# Altium schematic sheet UKU208_main.SchDoc
size A3
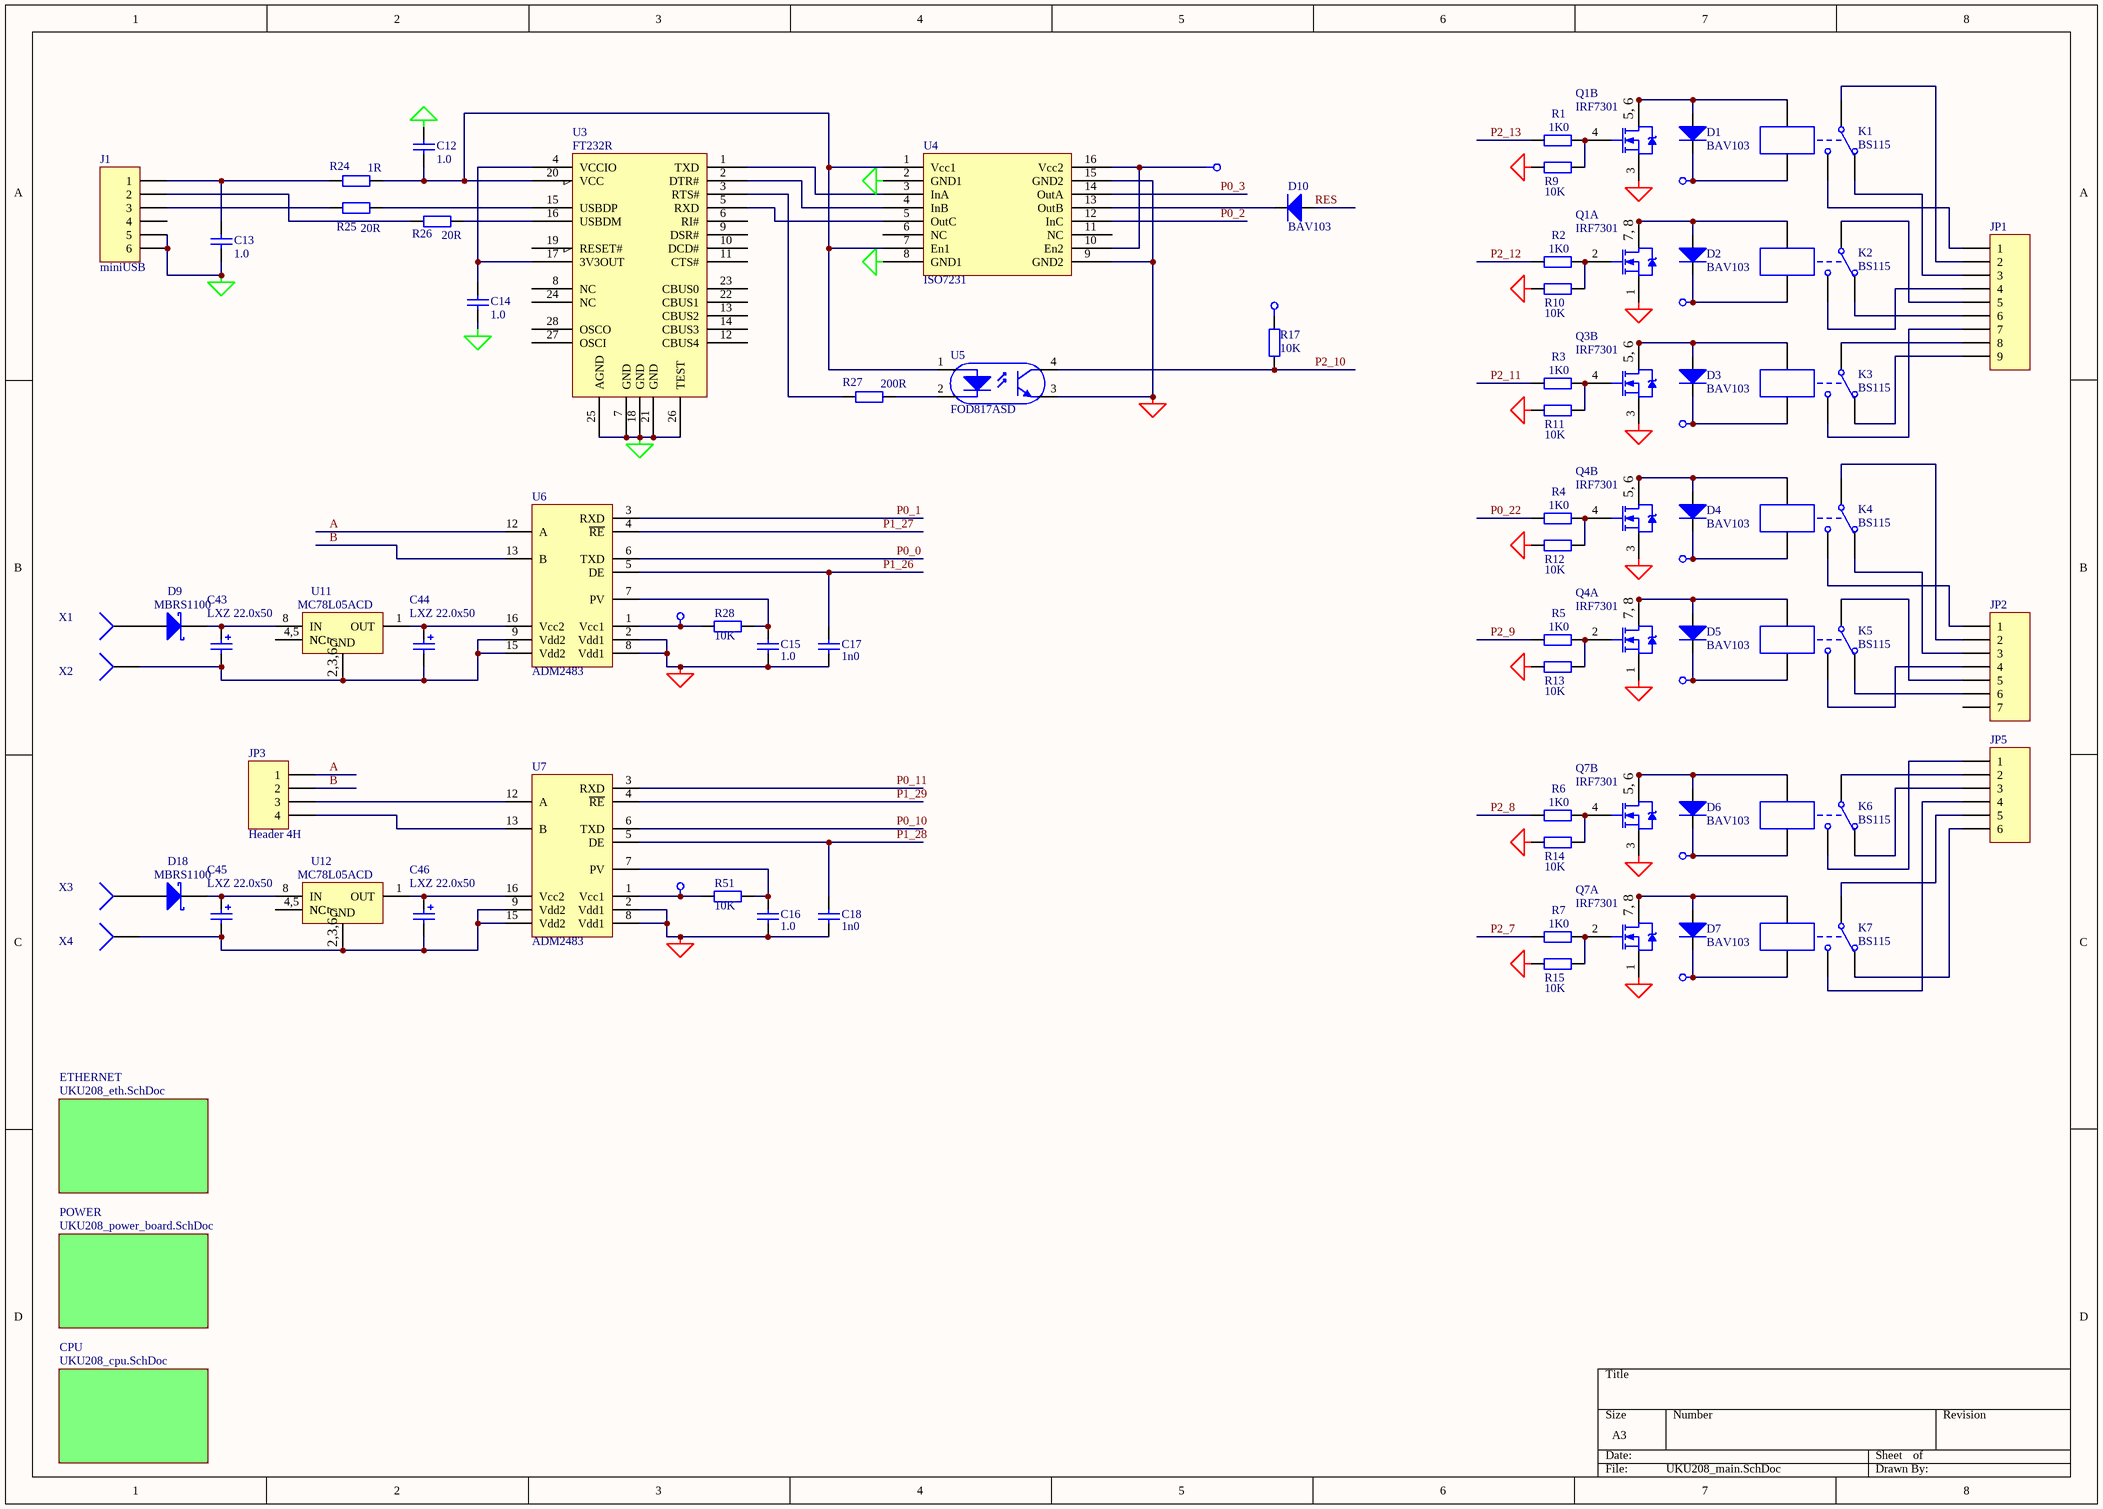
[diagram p0: UKU208_main.SchDoc]

## Parts
C12  1.0  [_1206]
C13  1.0  [_1206]
C14  1.0  [_1206]
C15  1.0  [_1206]
C16  1.0  [_1206]
C17  1n0  [_1206]
C18  1n0  [_1206]
C43  LXZ 22.0x50  [el3]
C44  LXZ 22.0x50  [el3]
C45  LXZ 22.0x50  [el3]
C46  LXZ 22.0x50  [el3]
D1  BAV103  [_1206d]
D2  BAV103  [_1206d]
D3  BAV103  [_1206d]
D4  BAV103  [_1206d]
D5  BAV103  [_1206d]
D6  BAV103  [_1206d]
D7  BAV103  [_1206d]
D9  MBRS1100  [D_6_3]
D10  BAV103  [_1206d]
D18  MBRS1100  [D_6_3]
J1  miniUSB  [USBmini]
JP1  MHDR1X9  [2EDGR-5.08-9P]  (value not drawn)
JP2  MHDR1X7  [2EDGR-5.08-7P]  (value not drawn)
JP3  Header 4H  [2EDGR-5.08-4P]
JP5  MHDR1X6  [2EDGR-5.08-6P]  (value not drawn)
K1  BS115  [bs115]
K2  BS115  [bs115]
K3  BS115  [bs115]
K4  BS115  [bs115]
K5  BS115  [bs115]
K6  BS115  [bs115]
K7  BS115  [bs115]
Q1  IRF7301  [SO-G8/Y2.2]  (parts A,B of 2)
Q3  IRF7301  [SO-G8/Y2.2]  (part B of 2)
Q4  IRF7301  [SO-G8/Y2.2]  (parts A,B of 2)
Q7  IRF7301  [SO-G8/Y2.2]  (parts A,B of 2)
R1  1K0  [_1206]
R2  1K0  [_1206]
R3  1K0  [_1206]
R4  1K0  [_1206]
R5  1K0  [_1206]
R6  1K0  [_1206]
R7  1K0  [_1206]
R9  10K  [_1206]
R10  10K  [_1206]
R11  10K  [_1206]
R12  10K  [_1206]
R13  10K  [_1206]
R14  10K  [_1206]
R15  10K  [_1206]
R17  10K  [_1206]
R24  1R  [_1206]
R25  20R  [_1206]
R26  20R  [_1206]
R27  200R  [_1206]
R28  10K  [_1206]
R51  10K  [_1206]
U3  FT232R  [SOP65P780-28L]
U4  ISO7231  [SO-G16/D10.4]
U5  FOD817ASD  [FOD817ASD]
U6  ADM2483  [SO-G16/D10.4]
U7  ADM2483  [SO-G16/D10.4]
U11  MC78L05ACD  [SO-G8]
U12  MC78L05ACD  [SO-G8]
X1  (no value)  [PIN1]
X2  (no value)  [PIN1]
X3  (no value)  [PIN1]
X4  (no value)  [PIN1]

## Sub-sheets
CPU = UKU208_cpu.SchDoc: no entries
ETHERNET = UKU208_eth.SchDoc: no entries
POWER = UKU208_power_board.SchDoc: no entries

## Nets
+3v3: R17.2
+5v: D1.2(K) D2.2(K) D3.2(K) D4.2(K) D5.2(K) D6.2(K) D7.2(K) K1.5 K2.5 K3.5 K4.5 K5.5 K6.5 K7.5 R28.1 R51.1 U4.10(En2) U4.16(Vcc2) U6.1(Vcc1) U7.1(Vcc1)
GND: C15.1 C16.1 C17.1 C18.1 Q1.1(S) Q1.3(S) Q3.3(S) Q4.1(S) Q4.3(S) Q7.1(S) Q7.3(S) R9.1 R10.1 R11.1 R12.1 R13.1 R14.1 R15.1 U4.9(GND2) U4.15(GND2) U5.3 U6.2(Vdd1) U6.8(Vdd1) U7.2(Vdd1) U7.8(Vdd1)
GND_USB: C12.1 C13.1 C14.1 J1.5 J1.6 U3.7(GND) U3.18(GND) U3.21(GND) U3.25(AGND) U3.26(TEST) U4.2(GND1) U4.8(GND1)
A: JP3.1 U6.12(A)
B: JP3.2 U6.13(B)
P0_0: U6.6(TXD)
P0_1: U6.3(RXD)
P0_2: U4.12(InC)
P0_3: U4.14(OutA)
P0_10: U7.6(TXD)
P0_11: U7.3(RXD)
P0_22: R4.1
P1_26: C17.2 U6.5(DE)
P1_27: U6.4(~{RE})
P1_28: C18.2 U7.5(DE)
P1_29: U7.4(~{RE})
P2_7: R7.1
P2_8: R6.1
P2_9: R5.1
P2_10: R17.1 U5.4
P2_11: R3.1
P2_12: R2.1
P2_13: R1.1
RES: D10.1(A)
NetC12_2: C12.2 R24.2 U3.20(VCC) U4.1(Vcc1) U4.7(En1) U5.1
NetC13_2: C13.2 J1.1 R24.1
NetC14_2: C14.2 U3.4(VCCIO) U3.17(3V3OUT)
NetC15_2: C15.2 R28.2 U6.7(PV)
NetC16_2: C16.2 R51.2 U7.7(PV)
NetC43_1: C43.1 D9.2(K) U11.8(IN)
NetC43_2: C43.2 C44.2 U6.9(Vdd2) U6.15(Vdd2) U11.2(GND) U11.3(GND) U11.6(GND) U11.7(GND) X2.1
NetC44_1: C44.1 U6.16(Vcc2) U11.1(OUT)
NetC45_1: C45.1 D18.2(K) U12.8(IN)
NetC45_2: C45.2 C46.2 U7.9(Vdd2) U7.15(Vdd2) U12.2(GND) U12.3(GND) U12.6(GND) U12.7(GND) X4.1
NetC46_1: C46.1 U7.16(Vcc2) U12.1(OUT)
NetD1_1: D1.1(A) K1.4 Q1.5(D) Q1.6(D)
NetD2_1: D2.1(A) K2.4 Q1.7(D) Q1.8(D)
NetD3_1: D3.1(A) K3.4 Q3.5(D) Q3.6(D)
NetD4_1: D4.1(A) K4.4 Q4.5(D) Q4.6(D)
NetD5_1: D5.1(A) K5.4 Q4.7(D) Q4.8(D)
NetD6_1: D6.1(A) K6.4 Q7.5(D) Q7.6(D)
NetD7_1: D7.1(A) K7.4 Q7.7(D) Q7.8(D)
NetD9_1: D9.1(A) X1.1
NetD10_2: D10.2(K) U4.13(OutB)
NetD18_1: D18.1(A) X3.1
NetJ1_2: J1.2 R26.1
NetJ1_3: J1.3 R25.1
NetJP1_1: JP1.1 K1.3
NetJP1_2: JP1.2 K1.1
NetJP1_3: JP1.3 K1.2
NetJP1_4: JP1.4 K2.3
NetJP1_5: JP1.5 K2.1
NetJP1_6: JP1.6 K2.2
NetJP1_7: JP1.7 K3.3
NetJP1_8: JP1.8 K3.1
NetJP1_9: JP1.9 K3.2
NetJP2_1: JP2.1 K4.3
NetJP2_2: JP2.2 K4.1
NetJP2_3: JP2.3 K4.2
NetJP2_4: JP2.4 K5.3
NetJP2_5: JP2.5 K5.1
NetJP2_6: JP2.6 K5.2
NetJP3_3: JP3.3 U7.12(A)
NetJP3_4: JP3.4 U7.13(B)
NetJP5_1: JP5.1 K6.3
NetJP5_2: JP5.2 K6.1
NetJP5_3: JP5.3 K6.2
NetJP5_4: JP5.4 K7.3
NetJP5_5: JP5.5 K7.1
NetJP5_6: JP5.6 K7.2
NetQ1_2: Q1.2(G) R2.2 R10.2
NetQ1_4: Q1.4(G) R1.2 R9.2
NetQ3_4: Q3.4(G) R3.2 R11.2
NetQ4_2: Q4.2(G) R5.2 R13.2
NetQ4_4: Q4.4(G) R4.2 R12.2
NetQ7_2: Q7.2(G) R7.2 R15.2
NetQ7_4: Q7.4(G) R6.2 R14.2
NetR25_2: R25.2 U3.15(USBDP)
NetR26_2: R26.2 U3.16(USBDM)
NetR27_1: R27.1 U3.3(RTS#)
NetR27_2: R27.2 U5.2
NetU3_1: U3.1(TXD) U4.3(InA)
NetU3_2: U3.2(DTR#) U4.4(InB)
NetU3_5: U3.5(RXD) U4.5(OutC)
NetU11_4: U11.4(NC) U11.5(NC)
NetU12_4: U12.4(NC) U12.5(NC)

Not connected (* = marked no-connect by the designer): J1 4; JP2 7; U3 6(RI#) 8(NC) 9(DSR#) 10(DCD#) 11(CTS#) 12(CBUS4) 13(CBUS2) 14(CBUS3) 19(RESET#) 22(CBUS1) 23(CBUS0) 24(NC) 27(OSCI) 28(OSCO); U4 6(NC) 11(NC)

## Notes on the sheet
- (in symbol IRF7301, part A) 7, 8
- (in symbol IRF7301, part B) 5, 6
- (in symbol MC78L05ACD) 4,5; 2,3,6,7

## Library data of the parts
C12-C18 = Cap Semi: Capacitor (Semiconductor SIM Model); Manufacturer: Generic Components; Class I: Passive; Value: 1,0; Published: 8-Jun-2000; Revision: July-2002: Re-released for DXP Platform.; Publisher: Altium Limited; Class II: Capacitor
C43-C46 = Cap Pol1: Polarized Capacitor (Radial); Manufacturer: Generic Components; Class I: Passive; Value: 22,0x50; Published: 8-Jun-2000; Revision: July-2002: Re-released for DXP Platform.; Publisher: Altium Limited; Class II: Capacitor
D1-D7 D10 = Diode: Manufacturer: Generic Components; Class I: Discrete; Class II: Diode - Switching; Value: LL4148; Published: 8-Jun-2000; Revision: July-2002: Re-released for DXP Platform.; Publisher: Altium Limited
D9 D18 = 10BQ015: Schottky Rectifier; Manufacturer: International Rectifier; Revision 1: 10-July-2000: SIM Model Added.; Revision 2: July-2002: Re-released for DXP Platform.; Class I: Discrete; Class II: Rectifier - Schottky; Published: 8-Jun-2000; Datasheet: Latest Revision: PD-2.396A; Package Reference: DO-214AA; Publisher: Altium Limited
J1 = Header 6: Header, 6-Pin; Value: USB-B; LatestRevisionDate: 17-Jul-2002; LatestRevisionNote: Re-released for DXP Platform.; Publisher: Altium Limited
JP1 = MHDR1X9: Header, 9-Pin; Manufacturer: Generic Components; Class I: Connector; Revision: July-2002: Re-released for DXP Platform.; Publisher: Altium Limited
JP2 = MHDR1X7: Header, 7-Pin; Manufacturer: Generic Components; Class I: Connector; Revision: July-2002: Re-released for DXP Platform.; Publisher: Altium Limited
JP3 = Header 4H: Header, 4-Pin,  Right Angle; Manufacturer: Generic Components; Class I: Connector; Revision: July-2002: Re-released for DXP Platform.; Publisher: Altium Limited
JP5 = MHDR1X6: Header, 6-Pin; Manufacturer: Generic Components; Class I: Connector; Revision: July-2002: Re-released for DXP Platform.; Publisher: Altium Limited
K1-K7 = BS115: Single-Pole Dual-Throw Relay; Manufacturer: Generic Components; Class I: Electro-mechanical; Published: 24-Mar-1999; Revision: July-2002: Re-released for DXP Platform.; Publisher: Altium Limited; Class II: Relay
Q1 Q3 Q4 Q7 = IRF7301: FET; Manufacturer: International Rectifier; Revision 1: 29-Sep-2000: Re-orientated a 'Drain' pin on first part.; Revision 2: July-2002: Re-released for DXP Platform.; Class I: Discrete; Class II: MOSFET - Power; Value: IRF7103; Published: 8-Jun-2000; Datasheet: Latest Revision: Aug-1997; Package Reference: SOIC8; Publisher: Altium Limited
R1-R7 = Res2: Resistor; Manufacturer: Generic Components; Class I: Passive; Rule: Undefined; Published: 8-Jun-2000; Revision: July-2002: Re-released for DXP Platform.; Publisher: Altium Limited; Class II: Resistor; Value: 1K0
R9-R15 = Res2: Resistor; Manufacturer: Generic Components; Class I: Passive; Published: 8-Jun-2000; Revision: July-2002: Re-released for DXP Platform.; Publisher: Altium Limited; Class II: Resistor; Value: 10K
R17 R28 R51 = Res2: Resistor; Manufacturer: Generic Components; Class I: Passive; Value: 1K0; Rule: Undefined; Published: 8-Jun-2000; Revision: July-2002: Re-released for DXP Platform.; Publisher: Altium Limited; Class II: Resistor
R24-R27 = RES: Body: 0603; Value: 22R; Type: S; Pins: 2
U3 = FT232R: Body: SSOP28LD; Value: FT232RL; Type: S; Pins: 20
U5 = F00817ASD
U11 U12 = MC78L05ACD: 3-Terminal Low-Current Positive Fixed Voltage Regulator; Manufacturer: Motorola; Class I: Power Management; Published: 15-Apr-2002; Datasheet: Linear and Interface Integrated Circuits, DL128 Rev2 (1988); Package Reference: 751-02; Publisher: Altium Limited; Class II: Voltage Regulator
X1-X4 = Socket: Manufacturer: Generic Components; Class I: Connector; Revision: July-2002: Re-released for DXP Platform.; Publisher: Altium Limited